# Altium schematic sheet Analogread_final.SchDoc
size 444 x 342 mm; SheetNumber: 1; SheetTotal: 1
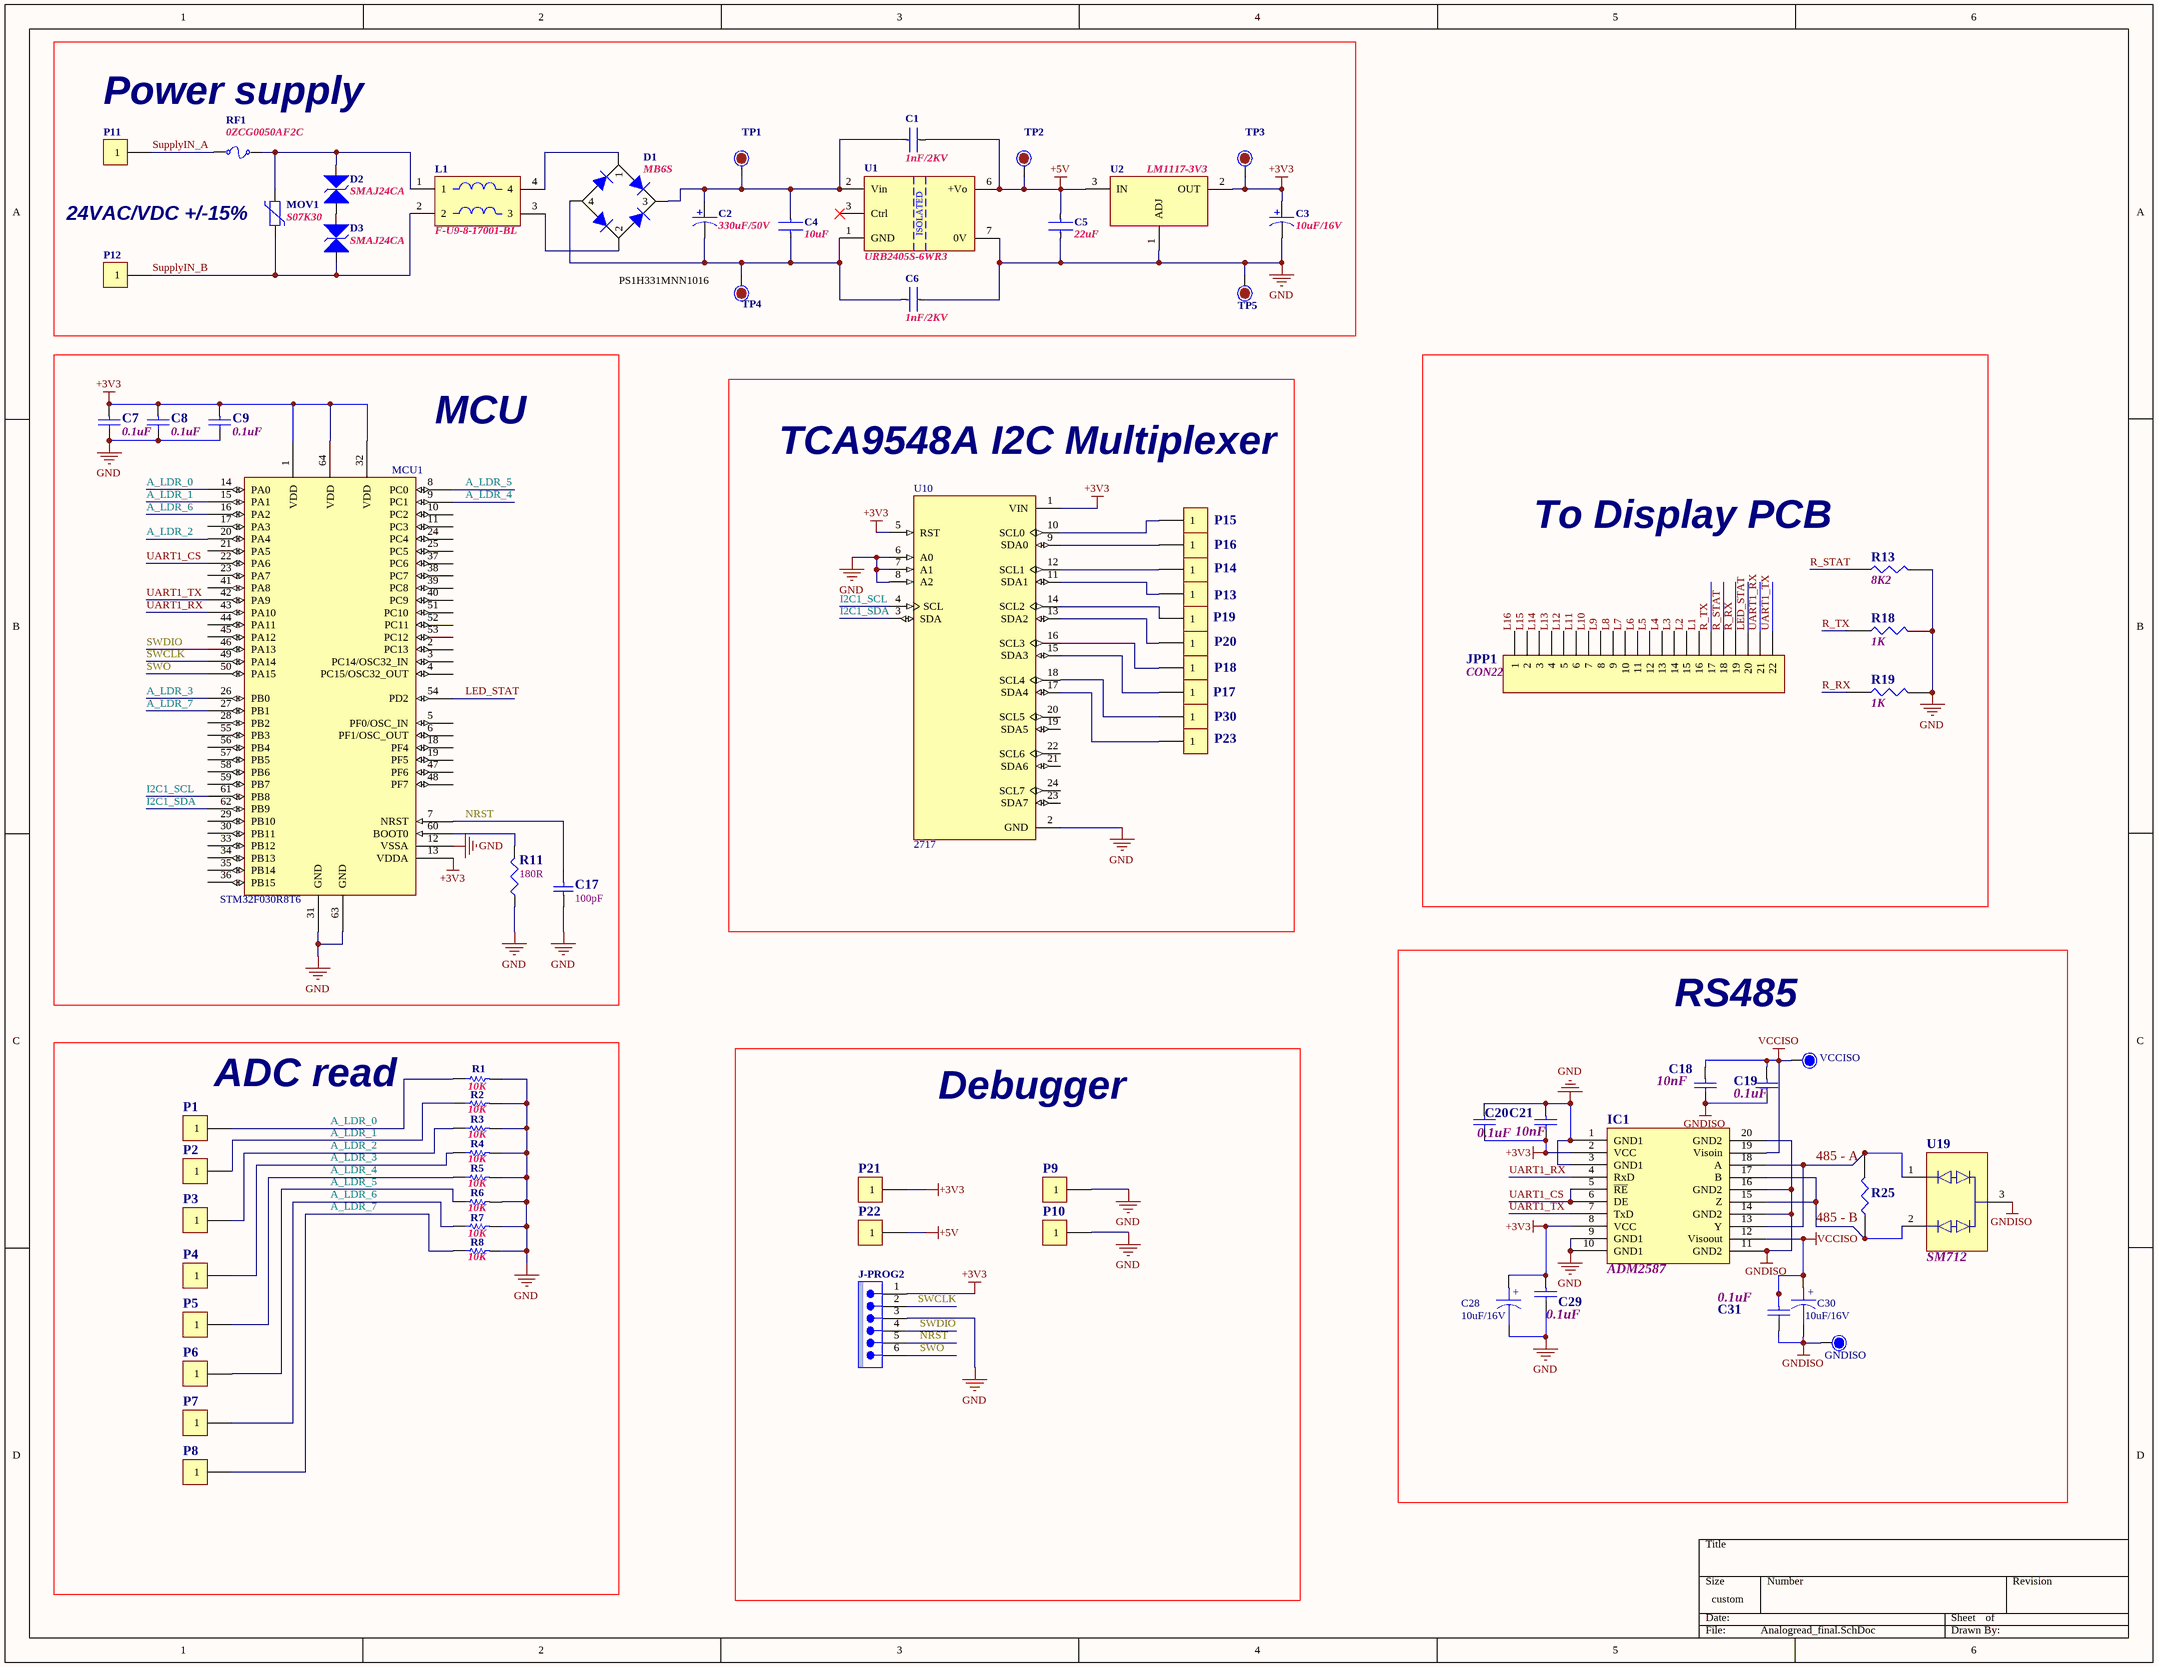
[diagram p0: Analogread_final.SchDoc]

## Parts
C1  1nF/2KV  [CAPS0.3]
C2  330uF/50V  [VER-D1000-H1250]
C3  10uF/16V  [CAPMP3528]
C4  10uF  [CAPC2013 (0805)]
C5  22uF  [CAPC2013 (0805)]
C6  1nF/2KV  [CAPS0.3]
C7  0.1uF  [CAPC1608 (0603)]
C8  0.1uF  [CAPC1608 (0603)]
C9  0.1uF  [CAPC1608 (0603)]
C17  100pF  [CAPC1608 (0603)]
C18  10nF  [0805]
C19  0.1uF  [CAPC1608 (0603)]
C20  0.1uF  [CAPC1608 (0603)]
C21  10nF  [0805]
C28  10uF/16V  [CAPMP3528]
C29  0.1uF  [CAPC1608 (0603)]
C30  10uF/16V  [CAPMP3528]
C31  0.1uF  [CAPC1608 (0603)]
D1  MB6S  [MB6S]
D2  SMAJ24CA  [SMA-(DO-214AC)]
D3  SMAJ24CA  [SMA-(DO-214AC)]
IC1  ADM2587  [SOIC-20]
J-PROG2  PIN HEADER 1x6  [PIN-HEADER 2.54 1x6]  (value not drawn)
JPP1  CON22  [JUMPER22]
L1  F-U9-8-17001-BL  [BT-1720]
MCU1  STM32F030R8T6  [QFP64 [10x10]]
MOV1  S07K30  [VARISTER(7MM)]
P1  CON1  [PAD_B3]  (value not drawn)
P2  CON1  [PAD_B3]  (value not drawn)
P3  CON1  [PAD_B3]  (value not drawn)
P4  CON1  [PAD_B3]  (value not drawn)
P5  CON1  [PAD_B3]  (value not drawn)
P6  CON1  [PAD_B3]  (value not drawn)
P7  CON1  [PAD_B3]  (value not drawn)
P8  CON1  [PAD_B3]  (value not drawn)
P9  CON1  [PAD_B3]  (value not drawn)
P10  CON1  [PAD_B3]  (value not drawn)
P11  1-PAD THT  [PAD-B3]  (value not drawn)
P12  1-PAD THT  [PAD-B3]  (value not drawn)
P13  CON1  [PAD_B3]  (value not drawn)
P14  CON1  [PAD_B3]  (value not drawn)
P15  CON1  [PAD_B3]  (value not drawn)
P16  CON1  [PAD_B3]  (value not drawn)
P17  CON1  [PAD_B3]  (value not drawn)
P18  CON1  [PAD_B3]  (value not drawn)
P19  CON1  [PAD_B3]  (value not drawn)
P20  CON1  [PAD_B3]  (value not drawn)
P21  CON1  [PAD_B3]  (value not drawn)
P22  CON1  [PAD_B3]  (value not drawn)
P23  CON1  [PAD_B3]  (value not drawn)
P30  CON1  [PAD_B3]  (value not drawn)
R1  10K  [RESC1608 (0603)]
R2  10K  [RESC1608 (0603)]
R3  10K  [RESC1608 (0603)]
R4  10K  [RESC1608 (0603)]
R5  10K  [RESC1608 (0603)]
R6  10K  [RESC1608 (0603)]
R7  10K  [RESC1608 (0603)]
R8  10K  [RESC1608 (0603)]
R11  180R  [0805]
R13  8K2  [RESC1608 (0603)]
R18  1K  [RESC1608 (0603)]
R19  1K  [RESC1608 (0603)]
R25  (no value)  [0805]
RF1  0ZCG0050AF2C  [0ZCGXXXXXXXX]
TP1  +VIN  [TP1-1.2mm]  (value not drawn)
TP2  +5V  [TP1-1.2mm]  (value not drawn)
TP3  +3V3  [TP1-1.2mm]  (value not drawn)
TP4  G_VIN  [TP1-1.2mm]  (value not drawn)
TP5  GND  [TP1-1.2mm]  (value not drawn)
TP6  VCCISO  [TP1-1.2mm]
TP7  GNDISO  [TP1-1.2mm]
U1  URB2405S-6WR3  [URBxxxxS-6WR3]
U2  LM1117-3V3  [SOT-223]
U10  2717  [MODULE_2717]
U19  SM712  [SOT-23-3]

## Blocks framed on the sheet
Power supply: C1-C6 D1-D3 L1 MOV1 P11 P12 RF1 TP1-TP5 U1 U2
MCU: C7-C9 C17 MCU1 R11
To Display PCB: JPP1 R13 R18 R19
TCA9548A I2C Multiplexer: P13-P20 P23 P30 U10
RS485: C18-C21 C28-C31 IC1 R25 TP6 TP7 U19
ADC read: P1-P8 R1-R8
Debugger: J-PROG2 P9 P10 P21 P22

## Nets
+3V3: C3.1 C7.1 C8.1 C9.1 C20.2 C21.2 C28.1 C29.1 IC1.2(VCC) IC1.8(VCC) J-PROG2.1 MCU1.1(VDD) MCU1.13(VDDA) MCU1.32(VDD) MCU1.64(VDD) P21.1 TP3.TP(Test_point) U2.2(OUT) U10.1(VIN) U10.5(RST)
+5V: C1.2 C5.2 P22.1 TP2.TP(Test_point) U1.6(+Vo) U2.3(IN)
GND: C3.2 C5.1 C6.2 C7.2 C8.2 C9.2 C17.1 C20.1 C21.1 C28.2 C29.2 IC1.1(GND1) IC1.3(GND1) IC1.9(GND1) IC1.10(GND1) J-PROG2.3 MCU1.12(VSSA) MCU1.31(GND) MCU1.63(GND) P9.1 P10.1 R1.1 R2.1 R3.1 R4.1 R5.1 R6.1 R7.1 R8.1 R11.1 R13.2 R18.2 R19.2 TP5.TP(Test_point) U1.7(0V) U2.1(ADJ) U10.2(GND) U10.6(A0) U10.7(A1) U10.8(A2)
GNDISO: C18.2 C19.2 C30.2 C31.2 IC1.11(GND2) IC1.14(GND2) IC1.16(GND2) IC1.20(GND2) TP7.TP(Test_point) U19.3
VCCISO: C18.1 C19.1 C30.1 C31.1 IC1.12(Visoout) IC1.19(Visoin) TP6.TP(Test_point)
485 - A: IC1.13(Y) IC1.18(A) R25.2 U19.1
485 - B: IC1.15(Z) IC1.17(B) R25.1 U19.2
A_LDR_0: MCU1.14(PA0) P1.1 R1.2
A_LDR_1: MCU1.15(PA1) P2.1 R2.2
A_LDR_2: MCU1.20(PA4) P3.1 R3.2
A_LDR_3: MCU1.26(PB0) P4.1 R4.2
A_LDR_4: MCU1.9(PC1) P5.1 R5.2
A_LDR_5: MCU1.8(PC0) P6.1 R6.2
A_LDR_6: MCU1.16(PA2) P7.1 R7.2
A_LDR_7: MCU1.27(PB1) P8.1 R8.2
I2C1_SCL: MCU1.61(PB8) U10.4(SCL)
I2C1_SDA: MCU1.62(PB9) U10.3(SDA)
L1: JPP1.16
L2: JPP1.15
L3: JPP1.14
L4: JPP1.13
L5: JPP1.12
L6: JPP1.11
L7: JPP1.10
L8: JPP1.9
L9: JPP1.8
L10: JPP1.7
L11: JPP1.6
L12: JPP1.5
L13: JPP1.4
L14: JPP1.3
L15: JPP1.2
L16: JPP1.1
LED_STAT: JPP1.20 MCU1.54(PD2)
NRST: C17.2 J-PROG2.5 MCU1.7(NRST)
R_RX: JPP1.19 R19.1
R_STAT: JPP1.18 R13.1
R_TX: JPP1.17 R18.1
SupplyIN_A: P11.1 RF1.1
SupplyIN_B: D3.A L1.2 MOV1.2 P12.1
SWCLK: J-PROG2.2 MCU1.49(PA14)
SWDIO: J-PROG2.4 MCU1.46(PA13)
SWO: J-PROG2.6 MCU1.50(PA15)
UART1_CS: IC1.5(~{RE}) IC1.6(DE) MCU1.22(PA6)
UART1_RX: IC1.4(RxD) JPP1.21 MCU1.43(PA10)
UART1_TX: IC1.7(TxD) JPP1.22 MCU1.42(PA9)
NetC1_1: C1.1 C2.1 C4.2 D1.3 TP1.TP(Test_point) U1.2(Vin)
NetC2_2: C2.2 C4.1 C6.1 D1.4 TP4.TP(Test_point) U1.1(GND)
NetD1_1: D1.1 L1.4
NetD1_2: D1.2 L1.3
NetD2_A: D2.A D3.C
NetD2_C: D2.C L1.1 MOV1.1 RF1.2
NetMCU1_60: MCU1.60(BOOT0) R11.2
NetP13_1: P13.1 U10.11(SDA1)
NetP14_1: P14.1 U10.12(SCL1)
NetP15_1: P15.1 U10.10(SCL0)
NetP16_1: P16.1 U10.9(SDA0)
NetP17_1: P17.1 U10.15(SDA3)
NetP18_1: P18.1 U10.16(SCL3)
NetP19_1: P19.1 U10.14(SCL2)
NetP20_1: P20.1 U10.13(SDA2)
NetP23_1: P23.1 U10.17(SDA4)
NetP30_1: P30.1 U10.18(SCL4)

Not connected (* = marked no-connect by the designer): MCU1 2(PC13) 3(PC14/OSC32_IN) 4(PC15/OSC32_OUT) 5(PF0/OSC_IN) 6(PF1/OSC_OUT) 10(PC2) 11(PC3) 17(PA3) 18(PF4) 19(PF5) 21(PA5) 23(PA7) 24(PC4) 25(PC5) 28(PB2) 29(PB10) 30(PB11) 33(PB12) 34(PB13) 35(PB14) 36(PB15) 37(PC6) 38(PC7) 39(PC8) 40(PC9) 41(PA8) 44(PA11) 45(PA12) 47(PF6) 48(PF7) 51(PC10) 52(PC11) 53(PC12) 55(PB3) 56(PB4) 57(PB5) 58(PB6) 59(PB7); U1 3(Ctrl)*; U10 19(SDA5) 20(SCL5) 21(SDA6) 22(SCL6) 23(SDA7) 24(SCL7)

## Notes on the sheet
- 24VAC/VDC +/-15%
- PS1H331MNN1016
- (in symbol CAPACITOR POL) +
- (in symbol URB2405S-6WR3) ISOLATED

## Library data of the parts
C1 C6 = CAP 0.3" (THD): CAP CER, ?F, ?V, ?, THT 0.3"; Capacitance: ?; ComponentLink1Description: Supplier; ComponentLink1URL: ?; Value: ?; Package: 0603
C2 = CAP ELEC D10 (THD): Aluminum Electrolytic Capacitor (Radial), / ?uF, ?V, Diameter 10mm; ComponentLink1Description: Supplier; ComponentLink1URL: ?; Capacitance: ?; Value: ?
C3 = CAP TANTALUM (SMD): CAP TANTALUM, ?uF, ?V, 1411; ComponentLink1Description: Supplier; ComponentLink1URL: ?; Capacitance: ?; Value: ?
C4 C5 = CAP CHIP 0805 (SMD): CAP CER, ?F, ?V, ±?%, 2013 (0805); Capacitance: ?; ComponentLink1Description: Supplier; ComponentLink1URL: ?; Value: ?; Package: 0805
C7-C9 C18-C21 C29 C31 = CAP: Capacitor
C17 = Cap: Capacitor; Published: 8-Jun-2000; LatestRevisionDate: 17-Jul-2002; LatestRevisionNote: Re-released for DXP Platform.; PackageReference: RAD-0.3; Publisher: Altium Limited; PackageDescription: Radial Cap, Thru-Hole; 2 Leads; 0.3 in Pin Spacing; Value: 100pF
C28 C30 = CAPACITOR POL: Capacitor
D2 D3 = DIODE TVS BI-DIR
IC1 = ADM2582E: Transceiver with ±15 kV ESD Protection
MCU1 = STM32F030R8T6: Value-line ARM-based 32-bit MCU with 64KB Flash, timers, ADC, communication interfaces, 2.4-3.6 V operation
MOV1 = Varistor D7: Disc Varistor 7mm
P1-P10 P13-P23 P30 = CON1: Connector
R1-R8 = RES CHIP 0603 (SMD): Chip Resistor, ? Ohm, +/-?%, ?W, 1608 (0603); Resistance: ?; ComponentLink1Description: Supplier; ComponentLink1URL: ?; Value: ?; Package: 0603
R11 = Res3: Resistor; Published: 8-Jun-2000; LatestRevisionDate: 29-May-2009; LatestRevisionNote: IPC-7351 Footprint Added.; PackageReference: J1-0603; Publisher: Altium Limited; PackageDescription: Chip Resistor; Value: 180R
R13 R18 R19 R25 = RES1
RF1 = 0ZCG0050AF2C: Polymeric PTC Resettable Fuse 30V 500 mA Ih Surface Mount 1812 (4532 Metric), Concave
TP1-TP7 = TP: TEST PAD
U1 = URB2405S-6WR3: 6W, Regulated, Isolated, DC to DC Converter, / 24V to 5V@1200mA
U2 = LM1117-3V3: Low-Dropout Linear Regulator 800 mA
U10 = 2717: Module: multiplexer; I2C interface multiplexer; TCA9548A; 3Ã·5VDC; MF: Adafruit; SnapEDA_Link: https://www.snapeda.com/parts/2717/Adafruit+Industries/view-part/?ref=snap; Package: None; Value: *; MP: 2717; Check_prices: https://www.snapeda.com/parts/2717/Adafruit+Industries/view-part/?ref=eda
U19 = SM712: Part Field 1: Suppressor; Part Field 2: Asymmetrical TVS Diode for RS485; Part Field 3: 1; Part Field 4: SOT-23; Part Field 5: SEMTECH; Part Field 6: SM712TCT; Part Field 7: Serial Micro.